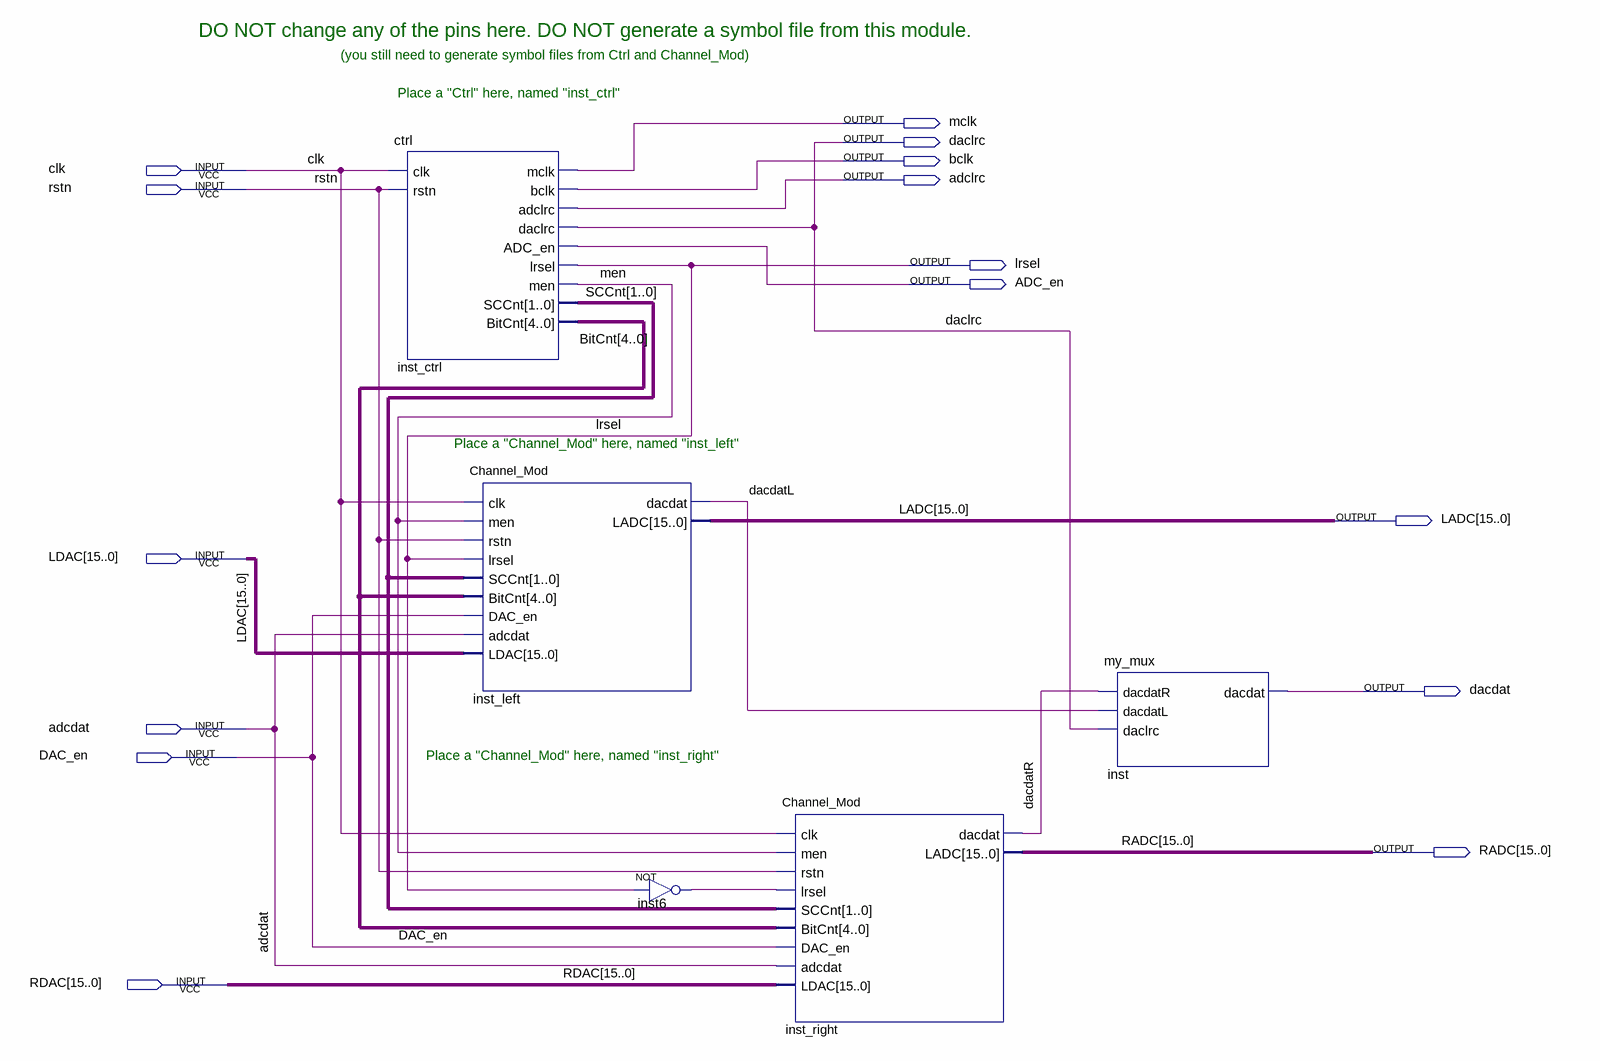
[diagram p0: schematic sheet]
// Quartus schematic SndDriver.bdf as structural Verilog: 5 symbols, 15 pins
module SndDriver (
  input  clk,
  input  rstn,
  input  [15:0] LDAC,
  input  adcdat,
  input  DAC_en,
  input  [15:0] RDAC,
  output mclk,
  output daclrc,
  output bclk,
  output adclrc,
  output lrsel,
  output ADC_en,
  output [15:0] LADC,
  output dacdat,
  output [15:0] RADC
);

  wire dacdatL, dacdatR, inst6_out, men;
  wire [1:0] SCCnt;
  wire [4:0] BitCnt;

  ctrl inst_ctrl (
    .clk(clk), .rstn(rstn), .mclk(mclk), .bclk(bclk), .adclrc(adclrc), .daclrc(daclrc), .ADC_en(ADC_en),
    .lrsel(lrsel), .men(men), .SCCnt(SCCnt), .BitCnt(BitCnt));
  Channel_Mod inst_left (
    .clk(clk), .men(men), .rstn(rstn), .lrsel(lrsel), .SCCnt(SCCnt), .BitCnt(BitCnt), .DAC_en(DAC_en),
    .adcdat(adcdat), .LDAC(LDAC), .dacdat(dacdatL), .LADC(LADC));
  not inst6 (inst6_out, lrsel);
  Channel_Mod inst_right (
    .clk(clk), .men(men), .rstn(rstn), .lrsel(inst6_out), .SCCnt(SCCnt), .BitCnt(BitCnt), .DAC_en(DAC_en),
    .adcdat(adcdat), .LDAC(RDAC), .dacdat(dacdatR), .LADC(RADC));
  my_mux inst (.dacdatR(dacdatR), .dacdatL(dacdatL), .daclrc(daclrc), .dacdat(dacdat));

  // Notes on the sheet:
  //   DO NOT change any of the pins here. DO NOT generate a symbol file from this module.
  //   (you still need to generate symbol files from Ctrl and Channel_Mod)
  //   Place a "Ctrl" here, named "inst_ctrl"
  //   Place a "Channel_Mod" here, named "inst_left"
  //   Place a "Channel_Mod" here, named "inst_right"
endmodule
